# EAGLE board uLements_v2.5 (EAGLE 9.2.1), part 1 of 2
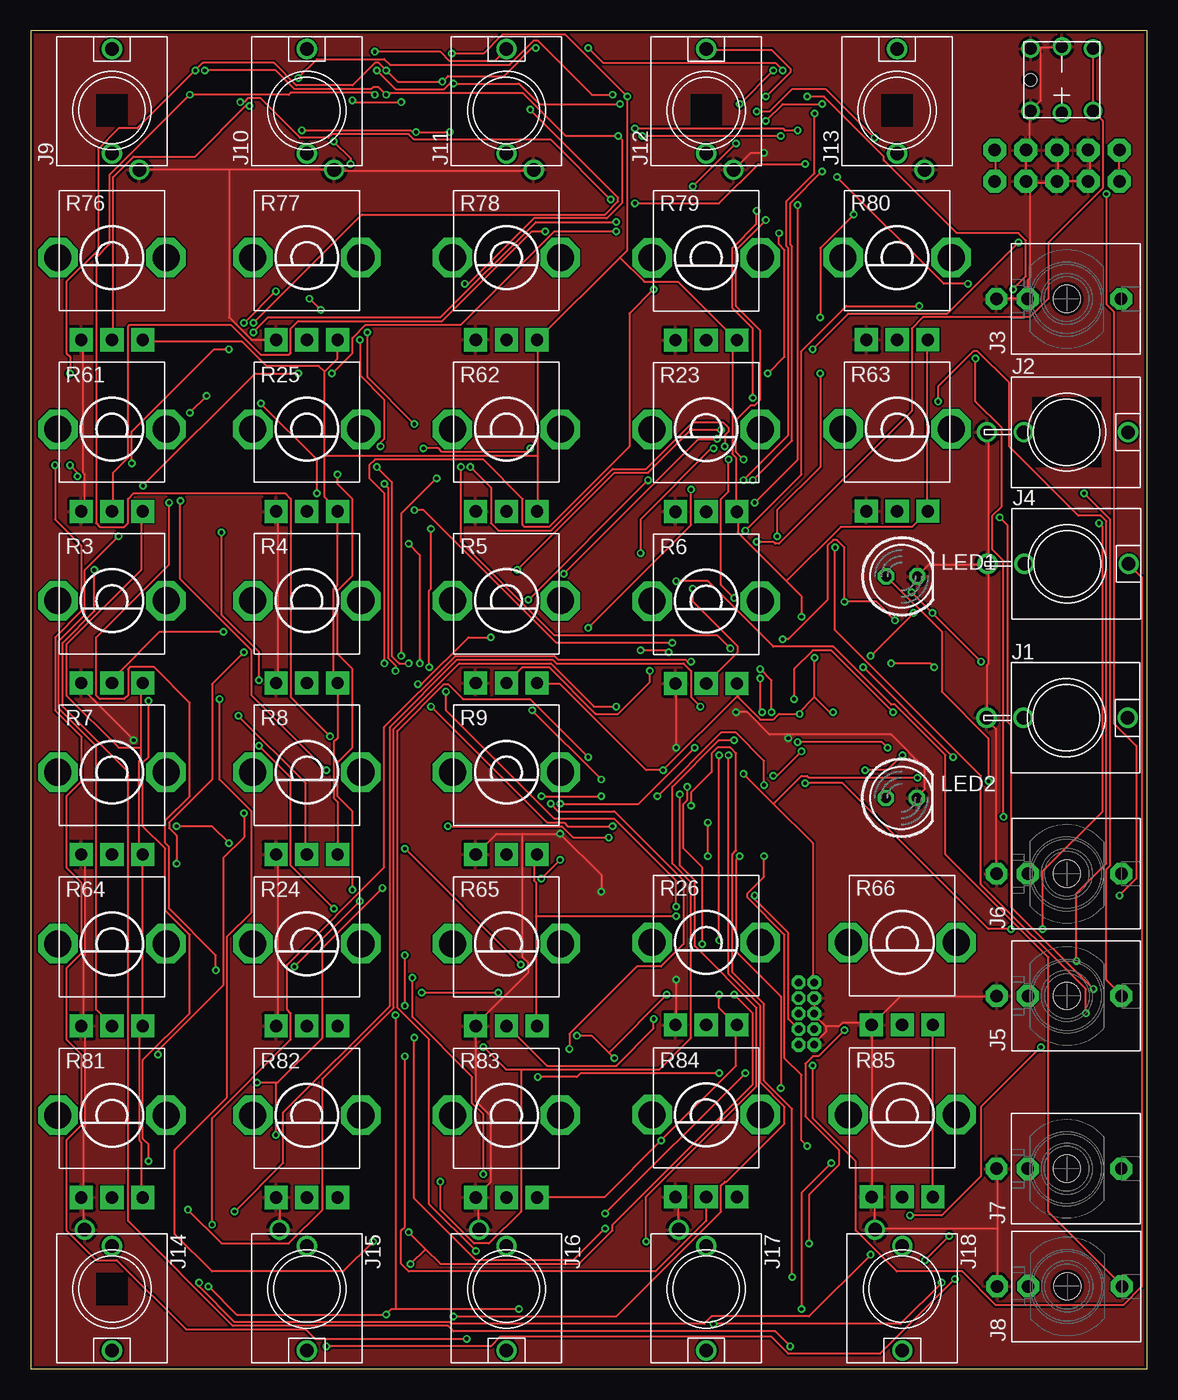
[diagram p5: board, top side]
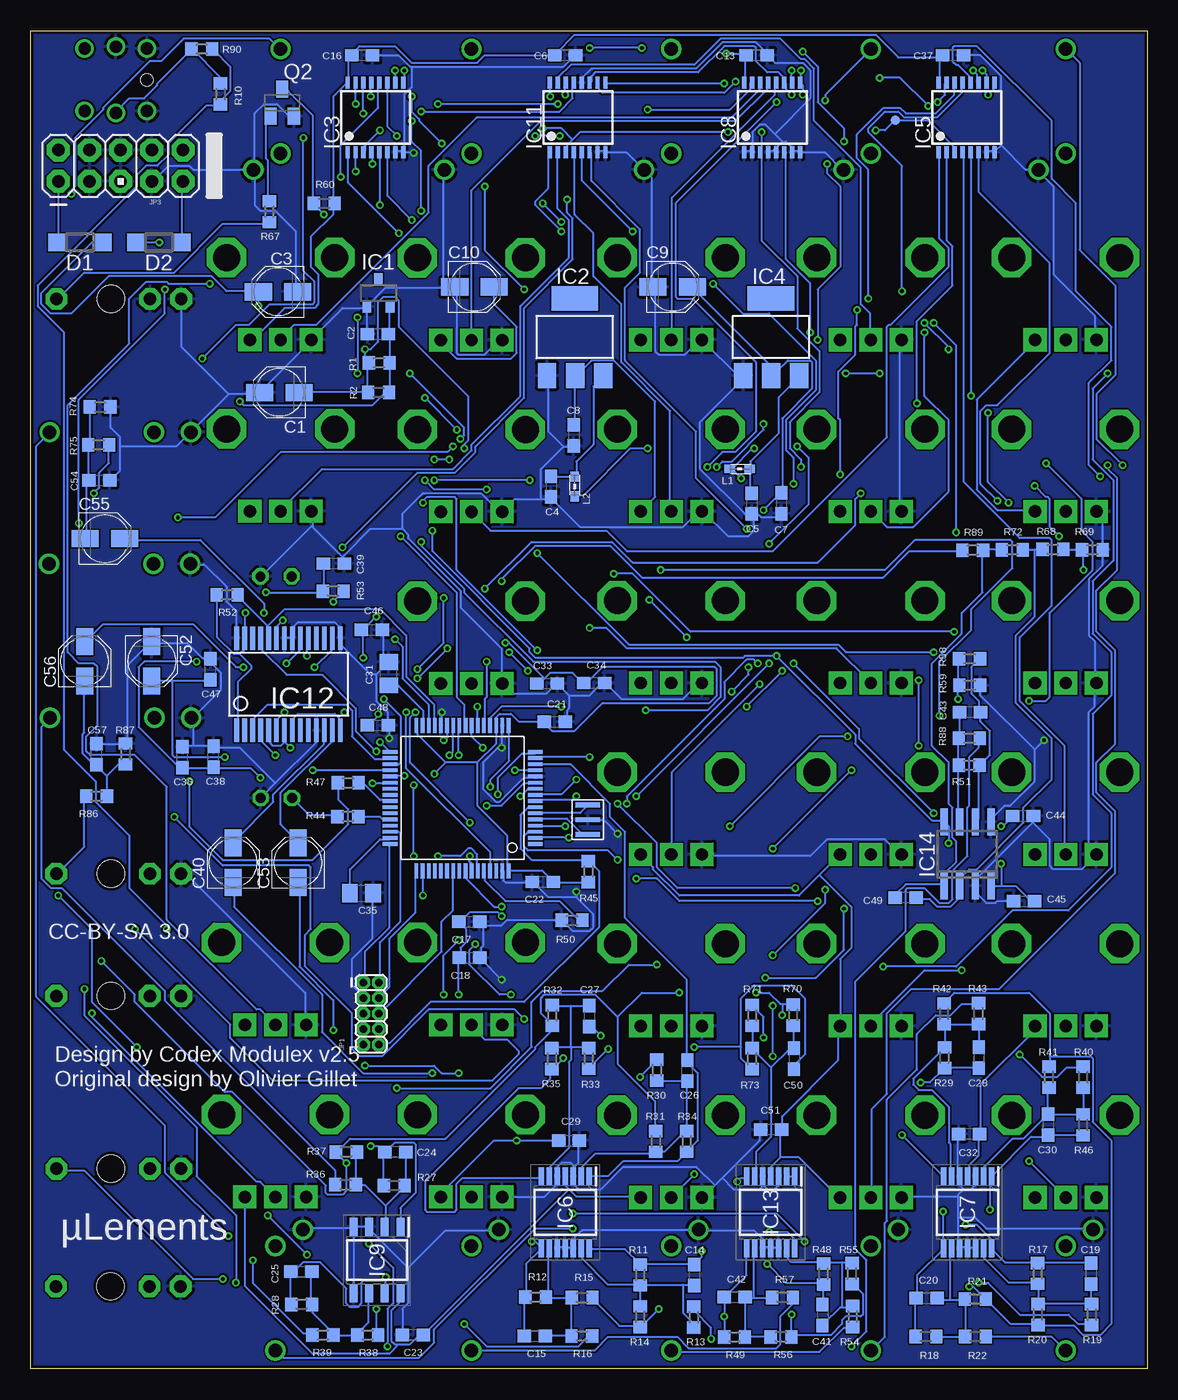
[diagram p6: board, bottom side, seen from below]

Size 90.94 x 109 mm. Coordinates in mm from the lower left corner, seen from the top.
Outline: 0,0 90.94,0 90.94,109 0,109 0,0
Copper layers (1*16): Top 0.035mm / dielectric 1.5mm / Bottom 0.035mm
Design rules "dirt_cheap_dirty_boards.v1.1": minimum track width 6mil, minimum drill 12mil, track to track 6mil, track to pad 6mil, pad to pad 6mil, via to via 6mil, smd to smd 0mil, copper to edge 10mil, drill to drill 10mil, minimum pad ring 10mil, minimum via ring 6mil, stop-mask expansion 2mil, vias tented up to drill 25mil, thermal gap 10mil

## Footprints (pad centres in the part's own frame; a part is rotated, then mirrored left to right if it is on the bottom)
PANASONIC_B = smd 2.2 x 1.4: + 1.6,0; - -1.6,0
C0603 = smd 1.1 x 1: 1 -0.85,0; 2 0.85,0
C0805 = smd 1.3 x 1.5: 1 -0.95,0; 2 0.95,0
SOD123 = smd 1.4 x 1.4: A 1.9,0; C -1.9,0
DBZ_R-PDSO-G3 = smd 0.7 x 1: 1 -0.95,-1.1; 2 0.95,-1.1; 3 0,1.1
SOT223 = smd 1.499 x 2.007: 1 -2.261,-3.15; 2 0.025,-3.15; 3 2.311,-3.15 | smd 3.81 x 2.007: 4 0,3.15
TSSOP16 = smd 0.35 x 1: 1 -1.95,-2.825; 2 -1.3,-2.825; 3 -0.65,-2.825; 4 0,-2.825; 5 0.65,-2.825; 6 1.3,-2.825; 7 1.95,-2.825; 8 2.6,-2.825; 9 2.6,2.825; 10 1.95,2.825; 11 1.3,2.825; 12 0.65,2.825; 13 0,2.825; 14 -0.65,2.825; 15 -1.3,2.825; 16 -1.95,2.825
SOP65P640X120-14N = smd 1.475 x 0.45: 1 -2.938,1.95; 2 -2.938,1.3; 3 -2.938,0.65; 4 -2.938,0; 5 -2.938,-0.65; 6 -2.938,-1.3; 7 -2.938,-1.95; 8 2.938,-1.95; 9 2.938,-1.3; 10 2.938,-0.65; 11 2.938,0; 12 2.938,0.65; 13 2.938,1.3; 14 2.938,1.95
SOIC127P600X175-8N = smd 1.5 x 0.65: 1 -2.7,1.905; 2 -2.7,0.635; 3 -2.7,-0.635; 4 -2.7,-1.905; 5 2.7,-1.905; 6 2.7,-0.635; 7 2.7,0.635; 8 2.7,1.905
TQFP-10X10-64 = smd 1.2 x 0.3: 1 -5.936,3.75; 2 -5.936,3.25; 3 -5.936,2.75; 4 -5.936,2.25; 5 -5.936,1.75; 6 -5.936,1.25; 7 -5.936,0.75; 8 -5.936,0.25; 9 -5.936,-0.25; 10 -5.936,-0.75; 11 -5.936,-1.25; 12 -5.936,-1.75; 13 -5.936,-2.25; 14 -5.936,-2.75; 15 -5.936,-3.25; 16 -5.936,-3.75; 33 5.886,-3.75; 34 5.886,-3.25; 35 5.886,-2.75; 36 5.886,-2.25; 37 5.886,-1.75; 38 5.886,-1.25; 39 5.886,-0.75; 40 5.886,-0.25; 41 5.886,0.25; 42 5.886,0.75; 43 5.886,1.25; 44 5.886,1.75; 45 5.886,2.25; 46 5.886,2.75; 47 5.886,3.25; 48 5.886,3.75 | smd 0.3 x 1.2: 17 -3.75,-5.911; 18 -3.25,-5.911; 19 -2.75,-5.911; 20 -2.25,-5.911; 21 -1.75,-5.911; 22 -1.25,-5.911; 23 -0.75,-5.911; 24 -0.25,-5.911; 25 0.25,-5.911; 26 0.75,-5.911; 27 1.25,-5.911; 28 1.75,-5.911; 29 2.25,-5.911; 30 2.75,-5.911; 31 3.25,-5.911; 32 3.75,-5.911; 49 3.75,5.936; 50 3.25,5.936; 51 2.75,5.936; 52 2.25,5.936; 53 1.75,5.936; 54 1.25,5.936; 55 0.75,5.936; 56 0.25,5.936; 57 -0.25,5.936; 58 -0.75,5.936; 59 -1.25,5.936; 60 -1.75,5.936; 61 -2.25,5.936; 62 -2.75,5.936; 63 -3.25,5.936; 64 -3.75,5.936
SSOP28 = smd 0.381 x 1.905: 1 -4.55,-3.752; 2 -3.9,-3.752; 3 -3.25,-3.752; 4 -2.6,-3.752; 5 -1.95,-3.752; 6 -1.3,-3.752; 7 -0.65,-3.752; 8 0,-3.752; 9 0.65,-3.752; 10 1.3,-3.752; 11 1.95,-3.752; 12 2.6,-3.752; 13 3.25,-3.752; 14 3.9,-3.752; 15 3.9,3.752; 16 3.25,3.752; 17 2.6,3.752; 18 1.95,3.752; 19 1.3,3.752; 20 0.65,3.752; 21 0,3.752; 22 -0.65,3.752; 23 -1.3,3.752; 24 -1.95,3.752; 25 -2.6,3.752; 26 -3.25,3.752; 27 -3.9,3.752; 28 -4.55,3.752
SO08 = smd 0.6 x 2.2: 1 -1.905,-2.6; 2 -0.635,-2.6; 3 0.635,-2.6; 4 1.905,-2.6; 5 1.905,2.6; 6 0.635,2.6; 7 -0.635,2.6; 8 -1.905,2.6
WQP-PJ301M-12_JACK = drill 1.1: P$1 0,5; P$2 0,-3.5; P$3 0,-6.5
WQP_PJ_301M6 = drill 1.016 pad 1.778 octagon: P1 0,-5.715; P2 0,-3.175; P3 0,4.445 | hole 2.2: 0,0
INSTRUO_S_JACK_S2_INV = drill 1.1: GND 2.223,-4.826; NORM 0,-3.5; TIP 0,5
2X5-1.27 = drill 0.61 pad 1.067 octagon: 1 -1.27,3.81; 2 0,3.81; 3 -1.27,2.54; 4 0,2.54; 5 -1.27,1.27; 6 0,1.27; 7 -1.27,0; 8 0,0; 9 -1.27,-1.27; 10 0,-1.27
AVR_ICSP = drill 1.016 pad 1.88 octagon: 1 -1.27,5.08; 2 1.27,5.08; 3 -1.27,2.54; 4 1.27,2.54; 5 -1.27,0; 6 1.27,0; 7 -1.27,-2.54; 8 1.27,-2.54; 9 -1.27,-5.08; 10 1.27,-5.08
0603 = smd 0.85 x 0.7: 1 -0.9,0; 2 0.7,0
LED5MM = drill 0.813 octagon: A -1.27,0; K 1.27,0
INSTRUO_CRYSTAL_SMALLER = smd 0.4 x 2: GND 0,0; X1 -1.2,0; X2 1.2,0
SOT23-BEC = smd 1 x 1.4: B -0.95,-1.1; C 0,1.1; E 0.95,-1.1
R0603 = smd 1 x 1.1: 1 -0.85,0; 2 0.85,0
OG-POTS_ALPS_POT_VERTICAL = drill 1 pad 1.88 square: P$1 -2.5,6.7; P$2 0,6.7; P$3 2.5,6.7 | drill 2.2 pad 3.175 octagon: P$4 -4.4,0; P$5 4.4,0
ALPS_POT_VERTICAL = drill 1 pad 1.88 square: P$1 -2.5,6.7; P$2 0,6.7; P$3 2.5,6.7 | drill 2.2 pad 3.175 octagon: P$4 -4.4,0; P$5 4.4,0
PAD.03X.03 = smd 0.762 x 0.762: P$1 0,0
INSTRUO_PB6149L = drill 1: 1 2.54,-2.54; 2 2.54,2.54; 3 -2.54,-2.54; 4 -2.54,2.54; A 0,-2.7; K 0,2.7 | hole 1: -2.54,0

## Placement (x,y rotation side)
C1  22u  [PANASONIC_B]  70.68,79.53 180 bottom
C2  100n  [C0603]  62.66,84.28 180 bottom
C3  22u  [PANASONIC_B]  70.79,87.73 180 bottom
C4  100n  [C0603]  48.55,71.86 270 bottom
C5  100n  [C0603]  32.2,70.48 270 bottom
C6  100n  [C0603]  47.41,107 0 bottom
C7  100n  [C0603]  29.79,70.5 270 bottom
C8  100n  [C0603]  46.71,76.03 270 bottom
C9  22u  [PANASONIC_B]  38.64,88.13 0 bottom
C10  22u  [PANASONIC_B]  54.79,88.13 0 bottom
C13  100n  [C0603]  31.79,107 0 bottom
C14  3.3n  [C0603]  36.89,7.64 270 bottom
C15  3.3n  [C0603]  49.88,2.68 0 bottom
C16  100n  [C0603]  63.95,107 0 bottom
C17  1u  [C0603]  55.21,36.42 0 bottom
C18  100n  [C0603]  55.19,33.49 0 bottom
C19  3.3n  [C0603]  4.55,7.76 270 bottom
C20  3.3n  [C0603]  17.97,5.76 0 bottom
C21  100n  [C0603]  48.24,52.7 0 bottom
C22  100n  [C0603]  49.23,39.66 180 bottom
C23  100n  [C0603]  59.81,2.76 180 bottom
C24  3.3n  [C0603]  61.24,17.65 180 bottom
C25  3.3n  [C0603]  68.89,7.93 0 bottom
C26  3.3n  [C0603]  37.44,24.3 90 bottom
C27  3.3n  [C0603]  45.44,28.74 270 bottom
C28  3.3n  [C0603]  13.71,25.33 270 bottom
C29  100n  [C0603]  47.09,18.6 0 bottom
C30  3.3n  [C0603]  8.05,19.89 270 bottom
C31  2.2u  [C0805]  61.77,56.63 90 bottom
C32  100n  [C0603]  14.49,19.13 180 bottom
C33  100n  [C0603]  48.88,55.82 0 bottom
C34  100n  [C0603]  45.03,55.86 0 bottom
C35  2.2u  [C0805]  63.99,38.75 0 bottom
C36  1u  [C0603]  78.57,49.82 90 bottom
C37  100n  [C0603]  15.79,107 0 bottom
C38  100n  [C0603]  76.04,49.86 90 bottom
C39  100n  [C0603]  66.24,65.6 0 bottom
C40  10u  [PANASONIC_B]  74.44,41.23 90 bottom
C41  3.3n  [C0603]  26.44,4.37 270 bottom
C42  3.3n  [C0603]  33.59,5.84 0 bottom
C43  18p  [C0603]  14.43,53.49 180 bottom
C44  100n  [C0603]  10.11,45.04 0 bottom
C45  100n  [C0603]  10.02,38.1 0 bottom
C46  100n  [C0603]  63.15,60.2 0 bottom
C47  100n  [C0603]  76.29,56.98 90 bottom
C48  1u  [C0603]  62.66,52.42 0 bottom
C49  18p  [C0603]  19.68,38.37 180 bottom
C50  3.3n  [C0603]  28.77,25.25 270 bottom
C51  100n  [C0603]  30.62,19.48 180 bottom
C52  10u  [PANASONIC_B]  81.09,57.63 270 bottom
C53  10u  [PANASONIC_B]  69.15,41.23 90 bottom
C54  220p  [C0603]  85.34,72.38 0 bottom
C55  10u  [PANASONIC_B]  84.89,67.63 0 bottom
C56  10u  [PANASONIC_B]  86.54,57.63 90 bottom
C57  220p  [C0603]  85.58,50.05 90 bottom
D1  1N5819HW  [SOD123]  86.92,91.75 180 bottom
D2  1N5819HW  [SOD123]  80.49,91.75 180 bottom
IC1  LM4040B10  [DBZ_R-PDSO-G3]  62.61,87.63 0 bottom
IC2  LM1117-3.3  [SOT223]  46.62,84.05 0 bottom
IC3  4051PW  [TSSOP16]  63.18,101.93 0 bottom
IC4  LM1117-3.3  [SOT223]  30.64,84.05 0 bottom
IC5  4051PW  [TSSOP16]  15.02,101.93 0 bottom
IC6  MCP6004-I_ST  [SOP65P640X120-14N]  47.4,12.75 270 bottom
IC7  MCP6004-I_ST  [SOP65P640X120-14N]  14.63,12.75 270 bottom
IC8  4051PW  [TSSOP16]  30.86,101.93 0 bottom
IC9  MCP6002-I_SN  [SOIC127P600X175-8N]  62.73,8.85 270 bottom
IC10  STM32F405RGT6  [TQFP-10X10-64]  55.77,46.5 180 bottom
IC11  4051PW  [TSSOP16]  46.71,101.93 0 bottom
IC12  WM8731  [SSOP28]  69.61,55.76 0 bottom
IC13  MCP6004-I_ST  [SOP65P640X120-14N]  30.66,12.75 270 bottom
IC14  LME49720  [SO08]  14.62,41.93 0 bottom
J1  [WQP-PJ301M-12_JACK]  84.37,53.03 270 top
J2  [WQP-PJ301M-12_JACK]  84.4,76.29 270 top
J3  PJ301_THONKICONN6  [WQP_PJ_301M6]  84.4,87.15 270 top
J4  [WQP-PJ301M-12_JACK]  84.44,65.57 270 top
J5  PJ301_THONKICONN6  [WQP_PJ_301M6]  84.41,30.37 270 top
J6  PJ301_THONKICONN6  [WQP_PJ_301M6]  84.4,40.33 270 top
J7  PJ301_THONKICONN6  [WQP_PJ_301M6]  84.4,16.3 270 top
J8  PJ301_THONKICONN6  [WQP_PJ_301M6]  84.44,6.72 270 top
J9  [INSTRUO_S_JACK_S2_INV]  6.62,102.5 0 top
J10  [INSTRUO_S_JACK_S2_INV]  22.5,102.5 0 top
J11  [INSTRUO_S_JACK_S2_INV]  38.76,102.5 0 top
J12  [INSTRUO_S_JACK_S2_INV]  55.03,102.5 0 top
J13  [INSTRUO_S_JACK_S2_INV]  70.58,102.5 0 top
J14  [INSTRUO_S_JACK_S2_INV]  6.62,6.5 180 top
J15  [INSTRUO_S_JACK_S2_INV]  22.5,6.5 180 top
J16  [INSTRUO_S_JACK_S2_INV]  38.76,6.5 180 top
J17  [INSTRUO_S_JACK_S2_INV]  55.03,6.5 180 top
J18  [INSTRUO_S_JACK_S2_INV]  71,6.5 180 top
JP1  M05X2MINIJTAG  [2X5-1.27]  62.57,27.66 0 bottom
JP3  M05X2PTH  [AVR_ICSP]  83.61,98 90 bottom
L1  [0603]  33.08,73.3 0 bottom
L2  [0603]  46.62,71.98 90 bottom
LED1  SSL-LX5093TC  [LED5MM]  70.96,64.55 0 top
LED2  SSL-LX5093PC  [LED5MM]  70.93,46.51 0 top
Q1  8MHz  [INSTRUO_CRYSTAL_SMALLER]  45.56,44.73 270 bottom
Q2  MMBT3904  [SOT23-BEC]  70.45,103.13 0 bottom
R1  1.0k  [R0603]  62.55,81.94 0 bottom
R2  1.0k  [R0603]  62.6,79.53 0 bottom
R3  10kB  [OG-POTS_ALPS_POT_VERTICAL]  6.62,62.57 180 top
R4  10kB  [OG-POTS_ALPS_POT_VERTICAL]  22.5,62.57 180 top
R5  10kB  [OG-POTS_ALPS_POT_VERTICAL]  38.76,62.57 180 top
R6  10kB  [OG-POTS_ALPS_POT_VERTICAL]  55.03,62.53 180 top
R7  10kB  [OG-POTS_ALPS_POT_VERTICAL]  6.62,48.6 180 top
R8  10kB  [OG-POTS_ALPS_POT_VERTICAL]  22.5,48.6 180 top
R9  10kB  [OG-POTS_ALPS_POT_VERTICAL]  38.76,48.6 180 top
R10  68  [R0603]  75.47,103.84 90 bottom
R11  20k  [R0603]  41.28,7.65 270 bottom
R12  20k  [R0603]  49.81,5.84 0 bottom
R13  100k  [R0603]  36.91,4.21 90 bottom
R14  120k  [R0603]  41.29,4.25 270 bottom
R15  120k  [R0603]  46.02,5.79 0 bottom
R16  100k  [R0603]  46.04,2.68 0 bottom
R17  20k  [R0603]  8.92,7.78 270 bottom
R18  20k  [R0603]  18,2.63 0 bottom
R19  100k  [R0603]  4.51,4.42 270 bottom
R20  120k  [R0603]  8.89,4.42 270 bottom
R21  120k  [R0603]  13.99,5.68 0 bottom
R22  100k  [R0603]  13.97,2.63 0 bottom
R23  10kB  [OG-POTS_ALPS_POT_VERTICAL]  55.03,76.52 180 top
R24  10kB  [OG-POTS_ALPS_POT_VERTICAL]  22.5,34.62 180 top
R25  10kB  [OG-POTS_ALPS_POT_VERTICAL]  22.5,76.54 180 top
R26  10kB  [OG-POTS_ALPS_POT_VERTICAL]  55.03,34.72 180 top
R27  47k  [R0603]  61.33,14.92 180 bottom
R28  20k  [R0603]  68.86,5.25 0 bottom
R29  20k  [R0603]  16.51,25.34 270 bottom
R30  100k  [R0603]  39.92,24.33 270 bottom
R31  200k  [R0603]  40.01,18.52 270 bottom
R32  120k  [R0603]  48.46,28.78 90 bottom
R33  100k  [R0603]  45.48,25.28 90 bottom
R34  33k  [R0603]  37.5,18.52 270 bottom
R35  20k  [R0603]  48.47,25.27 270 bottom
R36  100k  [R0603]  65.29,15 0 bottom
R37  180k  [R0603]  65.23,17.67 0 bottom
R38  120k  [R0603]  63.49,2.76 0 bottom
R39  100k  [R0603]  67.14,2.76 180 bottom
R40  100k  [R0603]  5.21,23.76 270 bottom
R41  120k  [R0603]  7.99,23.76 270 bottom
R42  120k  [R0603]  16.54,28.92 270 bottom
R43  100k  [R0603]  13.73,28.93 270 bottom
R44  2.2k  [R0603]  65.1,44.99 180 bottom
R45  10k  [R0603]  45.5,40.5 270 bottom
R46  20k  [R0603]  5.2,19.87 270 bottom
R47  2.2k  [R0603]  65.08,47.73 180 bottom
R48  20k  [R0603]  26.36,7.73 90 bottom
R49  20k  [R0603]  33.6,2.59 0 bottom
R50  10k  [R0603]  46.83,36.53 0 bottom
R51  47k  [R0603]  14.49,49.18 0 bottom
R52  2.2k  [R0603]  74.93,63.05 180 bottom
R53  2.2k  [R0603]  66.29,63.35 180 bottom
R54  100k  [R0603]  23.98,4.26 270 bottom
R55  120k  [R0603]  24.04,7.76 270 bottom
R56  120k  [R0603]  29.81,2.6 0 bottom
R57  100k  [R0603]  29.69,5.82 0 bottom
R58  6.8k  [R0603]  14.45,57.84 180 bottom
R59  47k  [R0603]  14.45,55.67 180 bottom
R60  10k  [R0603]  67.03,94.92 0 bottom
R61  10kB  [OG-POTS_ALPS_POT_VERTICAL]  6.62,76.54 180 top
R62  10kB  [OG-POTS_ALPS_POT_VERTICAL]  38.76,76.54 180 top
R63  10kB  [OG-POTS_ALPS_POT_VERTICAL]  70.58,76.56 180 top
R64  10kB  [OG-POTS_ALPS_POT_VERTICAL]  6.62,34.62 180 top
R65  10kB  [OG-POTS_ALPS_POT_VERTICAL]  38.76,34.62 180 top
R66  10kB  [OG-POTS_ALPS_POT_VERTICAL]  71,34.72 180 top
R67  100k  [R0603]  71.49,94.26 90 bottom
R68  6.8k  [R0603]  7.67,66.74 0 bottom
R69  47k  [R0603]  4.45,66.72 180 bottom
R70  120k  [R0603]  28.83,28.81 270 bottom
R71  100k  [R0603]  32.16,28.79 270 bottom
R72  47k  [R0603]  10.97,66.72 0 bottom
R73  20k  [R0603]  32.18,25.26 270 bottom
R74  6.8k  [R0603]  85.29,78.34 180 bottom
R75  36k  [R0603]  85.4,75.26 0 bottom
R76  10kB  [ALPS_POT_VERTICAL]  6.62,90.52 180 top
R77  10kB  [ALPS_POT_VERTICAL]  22.5,90.52 180 top
R78  10kB  [ALPS_POT_VERTICAL]  38.76,90.52 180 top
R79  10kB  [ALPS_POT_VERTICAL]  55.03,90.5 180 top
R80  10kB  [ALPS_POT_VERTICAL]  70.58,90.52 180 top
R81  10kB  [ALPS_POT_VERTICAL]  6.62,20.65 180 top
R82  10kB  [ALPS_POT_VERTICAL]  22.5,20.65 180 top
R83  10kB  [ALPS_POT_VERTICAL]  38.76,20.65 180 top
R84  10kB  [ALPS_POT_VERTICAL]  55.03,20.7 180 top
R85  10kB  [ALPS_POT_VERTICAL]  71,20.7 180 top
R86  36k  [R0603]  85.57,46.64 180 bottom
R87  6.8k  [R0603]  83.2,50.09 270 bottom
R88  1.0k  [R0603]  14.48,51.36 180 bottom
R89  1.0k  [R0603]  14.2,66.69 0 bottom
R90  68  [R0603]  77,107.5 180 bottom
TP1  ADC_TEST  [PAD.03X.03]  20.5,101.7 90 bottom
U$1  INSTRUO_PB6149_FIXED  [INSTRUO_PB6149L]  84,105 0 top

## Tracks (layer width: path | path; a pad name or v marks a point on that pad's centre or on a via)
+3V3  (via drill 0.3)
  Top 0.152: v71.78,63.25 v73.46,61.57 v77.42,57.61 | v58.06,48.46 60.5,46.02 | 60.5,46.02 63.7,42.82 63.7,31.55 JP1.1 | v31.24,69.95 32,69.95 42.82,59.13 v52.27,59.13 | v72.24,48.16 63.4,48.16 63.25,48.31 62.79,48.31 60.5,46.02
  Bottom 0.152: C39.1 67.06,65.53 67.06,63.4 R53.2 67.21,63.25 v71.78,63.25 | 73.91,58.22 74.37,58.22 75.74,59.59 75.74,62.94 R52.2 | 73.91,58.22 73.61,58.52 73.61,59.44 IC12.27 73.46,59.59 v73.46,61.57 | 73.91,58.22 73,57.3 73,57 74.07,55.93 74.07,52.12 IC12.1 | v77.42,57.61 81.69,57.61 82.14,57.15 82.14,52.27 78.94,49.07 78.64,49.07 C36.1 78.49,48.92 76.05,48.92 C38.1 75.89,48.92 73,48.92 v72.24,48.16 | 30.18,81.23 30.48,80.92 IC4.2 30.18,81.23 | 30.18,81.23 29.26,82.14 27.43,82.14 27.28,81.99 27.28,79.86 29.72,77.42 29.72,71.48 C7.1 29.87,71.32 v31.24,69.95 | 30.18,81.23 37.03,88.09 C9.+ | IC10.48 61.72,42.67 61.72,35.97 63.7,33.98 63.7,31.55 JP1.1 | R45.2 45.57,39.62 48.31,39.62 C22.1 48.46,39.78 49.23,40.54 51.97,40.54 IC10.64 52.12,40.69 52.12,43.43 54.56,45.87 54.56,49.38 | 49.07,56.24 48.62,56.69 46.79,56.69 46.02,55.93 C34.1 45.87,55.93 45.57,55.93 44.35,57.15 35.2,57.15 35.05,57 35.05,54.86 35.66,54.25 44.35,54.25 46.63,51.97 48.46,51.97 49.07,52.58 C21.1 49.23,52.73 51.21,52.73 51.82,53.34 52.73,53.34 53.03,53.03 53.03,52.43 IC10.19 53.03,52.27 53.03,50.9 54.56,49.38 | 49.07,56.24 49.38,55.93 49.68,55.93 C33.1 | 57.15,49.38 59.44,51.66 59.44,52.27 IC10.32 | 54.56,49.38 57.15,49.38 | 57.15,49.38 v58.06,48.46 | v52.27,59.13 51.97,59.13 49.07,56.24
+3V3_A  (via drill 0.3)
  Top 0.152: 62.48,53.34 60.96,53.34 60.5,52.88 59.44,52.88 57.61,54.71 57.61,54.86 | 57.61,54.86 57.61,55.78 R6.P$1 | 63.86,54.71 v63.86,57.91 | 62.48,53.34 63.86,54.71 | 62.48,53.34 v62.64,53.34 | 57.61,54.86 v51.51,48.77 50.14,48.77 43.13,55.78 41.3,55.78 R5.P$1 | v65.38,53.49 65.08,53.49 63.86,54.71 | 48.01,90.53 41.3,83.82 R78.P$1 41.3,83.67 41.3,74.37 | 48.01,90.53 48.62,91.14 v48.62,103.63 43.59,108.66 38.41,108.66 36.88,107.14 v34.29,107.14 | 41.3,74.37 41.3,69.95 R62.P$1 | 48.01,90.53 49.99,88.54 52.73,88.54 57.45,83.82 R79.P$1 57.45,83.67 57.15,83.36 57.15,74.52 57.45,74.22 57.45,69.95 R23.P$1 57.61,69.8 57.61,68.12 61.57,64.16 | v62.79,61.27 62.79,62.94 61.57,64.16 | R80.P$1 73,83.82 73,69.95 R63.P$1 73,69.8 71.78,68.58 65.99,68.58 61.57,64.16 | R85.P$1 73.46,14.02 73.46,27.89 R66.P$1 | v56.08,30.48 56.08,29.41 57.45,28.04 R26.P$1 57.45,27.89 57.45,24.69 v51.36,18.59 46.79,14.02 41.3,14.02 R83.P$1 | R81.P$1 8.99,14.02 8.99,18.44 8.84,18.59 8.84,27.74 8.99,27.89 R64.P$1 9.14,28.04 9.14,41.76 R7.P$1 8.99,41.91 8.84,42.06 8.84,49.53 8.99,49.68 8.99,50.6 | 8.99,50.6 8.99,55.78 R3.P$1 | 41.15,36.88 41.15,39.62 41,39.78 41,41.6 41.15,41.76 R9.P$1 | 41.15,36.88 41.15,28.04 R65.P$1 | R8.P$1 24.99,46.18 24.69,46.48 24.69,51.05 24.99,51.36 24.99,55.78 R4.P$1 24.99,55.93 24.69,56.24 24.69,63.55 24.99,63.86 24.99,69.8 R25.P$1 24.99,69.95 23.93,71.02 23.93,74.37 | 23.93,81.23 24.99,82.3 24.99,83.67 R77.P$1 | 23.93,74.37 23.93,81.23 | 23.93,81.23 23.47,81.69 19.2,81.69 17.22,83.67 9.14,83.67 R76.P$1 | 8.99,50.6 7.16,50.6 2.9,54.86 2.9,58.98 8.99,65.08 8.99,69.8 R61.P$1
  Top 0.152: 41.15,36.88 v52.58,36.88 | 23.93,74.37 41.3,74.37
  Bottom 0.152: 65.84,53.03 65.84,52.12 IC12.14 | 65.84,53.03 66.14,53.34 69.19,53.34 69.49,53.03 69.49,52.12 IC12.8 | v62.64,53.34 62.64,53.19 63.4,52.43 C48.1 | v63.86,57.91 63.86,60.05 C46.1 63.86,60.2 v62.79,61.27 | v51.51,48.77 49.84,48.77 IC10.13 | v65.38,53.49 65.84,53.03 | C10.+ 53.19,88.09 53.19,86.72 51.36,84.89 51.36,82.75 51.82,82.3 56.24,82.3 57.61,83.67 R79.P$1 | C8.1 46.63,76.96 46.63,80.77 IC2.2 46.48,80.92 45.26,82.14 43.43,82.14 40.08,78.79 40.08,71.02 41.15,69.95 R62.P$1 | IC8.16 32.77,104.85 32.77,106.98 C13.1 32.77,107.14 v34.29,107.14 | v48.62,103.63 48.62,104.7 IC11.16 | 16.92,106.83 16.92,104.85 IC5.16 | 16.92,106.83 16.76,106.98 C37.1 16.92,106.83 | 16.92,106.83 20.27,106.83 22.1,108.66 46.63,108.66 48.16,107.14 C6.1 48.31,106.98 53.95,106.98 54.56,106.38 59.89,106.38 61.27,107.75 64.16,107.75 64.77,107.14 C16.1 64.92,106.98 65.08,106.83 65.08,104.85 IC3.16 65.23,104.7 66.29,103.63 66.29,94.94 R60.2 66.29,94.79 66.29,94.03 68.12,92.2 68.12,89.76 67.51,89.15 67.51,86.72 67.82,86.41 70.26,86.41 72.69,83.97 73,83.97 R80.P$1 | C29.1 48.01,18.59 v51.36,18.59 53.19,18.59 57.45,14.33 57.45,14.02 R84.P$1 | v56.08,30.48 56.08,33.38 C18.1 55.93,33.53 55.93,34.29 55.47,34.75 55.47,35.81 55.93,36.27 C17.1 55.93,36.42 55.17,37.19 52.88,37.19 v52.58,36.88 | 60.96,1.98 61.27,1.98 61.57,2.29 61.57,4.72 60.96,5.33 60.96,6.1 IC9.8 | 60.96,1.98 60.05,1.98 59.28,2.74 58.98,2.74 C23.1 58.83,2.9 47.09,14.63 | 47.09,14.63 46.48,14.02 41.3,14.02 R83.P$1 | 47.09,14.63 47.4,14.94 47.4,15.54 IC6.4 | 60.96,1.98 61.72,1.22 67.97,1.22 73.46,6.71 73.46,13.87 R85.P$1
  Bottom 0.152: IC7.4 14.48,15.7 14.48,16.61 13.72,17.37 13.72,19.05 C32.1 13.56,19.2 13.56,23.16 9.14,27.58 9.14,27.89 R64.P$1 | 29.87,17.22 29.87,19.36 C51.1 29.72,19.51 29.72,20.57 25.15,25.15 25.15,27.89 R24.P$1 24.99,28.04 24.99,33.38 24.08,34.29 24.08,37.64 26.67,40.23 | 29.87,17.22 30.63,16.46 30.63,15.7 IC13.4 | 29.87,17.22 28.35,17.22 25.15,14.02 R82.P$1 | R61.P$1 9.14,69.95 12.19,69.95 13.87,71.63 13.87,78.94 9.14,83.67 R76.P$1 | 26.67,40.23 25.15,41.76 R8.P$1 | 26.67,40.23 28.35,38.56 38.1,38.56 40.23,40.69 40.23,40.84 41.15,41.76 R9.P$1
ADC_ADDR_0  (via drill 0.3)
  Top 0.152: v14.17,105.77 19.96,105.77 21.49,104.24 27.74,104.24 27.89,104.39 28.35,104.39 28.8,103.94 | v49.84,100.43 v61.11,100.43 | 28.8,103.94 40.08,103.94 43.59,100.43 v47.85,100.43 48.16,100.13 48.16,94.94 46.94,93.73 41,93.73 35.66,88.39 v35.36,88.39 | 28.8,103.94 v28.96,103.78 | v47.4,44.2 43.74,44.2 43.43,44.5 42.06,44.5 v32.61,53.95 | v29.72,56.84 29.72,57.3 29.11,57.91 29.11,71.78 v28.8,72.08
  Bottom 0.152: v14.17,105.77 13.87,105.46 13.87,104.85 IC5.11 | v28.96,103.78 29.41,104.24 29.41,104.7 IC8.11 29.57,104.85 29.57,105.16 30.02,105.61 30.94,105.61 31.85,106.53 31.85,107.59 32,107.75 34.44,107.75 36.58,105.61 44.96,105.61 45.26,105.31 45.26,104.85 IC11.11 | v61.11,100.43 61.87,101.19 61.87,104.7 IC3.11 | v47.85,100.43 v49.84,100.43 | v47.4,44.2 49.68,44.2 IC10.4 | v29.72,56.84 v32.61,53.95 | v28.8,72.08 28.8,74.22 29.41,74.83 29.41,77.27 26.98,79.7 26.98,82.14 30.79,85.95 32.92,85.95 v35.36,88.39
ADC_ADDR_1  (via drill 0.3)
  Top 0.152: v61.27,105.77 60.66,106.38 46.63,106.38 v45.41,107.59 | v41.15,107.59 40.84,107.59 38.56,105.31 33.98,105.31 v33.53,104.85 29.87,104.85 v28.96,105.77 28.35,106.38 28.04,106.38 26.21,104.55 21.64,104.55 19.81,106.38 14.02,106.38 v13.41,105.77 8.69,101.04 7.16,101.04 5.49,99.36 5.49,91.14 2.9,88.54 2.9,82.75 3.2,82.45 v3.2,81.08 | v41.6,39.93 v43.13,41.45 | v21.49,32.77 v26.82,38.1
  Bottom 0.152: v13.41,105.77 13.11,105.46 13.11,104.85 IC5.10 | v28.96,105.77 28.96,104.85 IC8.10 | v33.53,104.85 34.44,103.94 44.35,103.94 44.65,104.24 44.65,104.7 IC11.10 | v61.27,105.77 61.27,104.85 IC3.10 | v41.15,107.59 v45.41,107.59 | v43.13,41.45 43.89,42.22 50.44,42.22 50.75,42.52 50.75,43.43 50.44,43.74 49.84,43.74 IC10.3 | v41.6,39.93 39.93,39.93 38.1,38.1 v26.82,38.1 | v21.49,32.77 15.54,32.77 10.97,37.34 6.4,37.34 2.9,40.84 2.9,45.26 4.42,46.79 4.42,53.34 2.9,54.86 2.9,58.37 4.42,59.89 4.42,64.16 2.74,65.84 2.74,72.39 4.42,74.07 4.42,79.86 v3.2,81.08
ADC_ADDR_2  (via drill 0.3)
  Top 0.152: v28.04,103.78 27.89,103.94 21.18,103.94 21.03,103.78 v12.95,103.78 6.4,97.23 6.4,91.59 5.33,90.53 5.33,68.89 5.64,68.58 7.62,68.58 7.92,68.89 7.92,70.87 8.38,71.32 20.73,71.32 21.18,70.87 21.18,54.71 v24.38,51.51 | v28.19,105.77 29.72,104.24 33.68,104.24 34.14,104.7 v34.44,104.7 39.78,104.7 41.45,103.02 v48.01,103.02 | v57.76,103.02 v60.5,105.77 | v47.09,43.28 44.2,43.28 43.28,44.2 v33.98,44.2
  Bottom 0.152: v12.95,103.78 12.5,104.24 12.5,104.7 IC5.9 | v28.04,103.78 28.04,104.55 28.19,104.7 IC8.9 28.19,104.85 v28.19,105.77 | v34.44,104.7 44.04,104.7 IC11.9 | v60.5,105.77 60.5,104.85 IC3.9 | v48.01,103.02 v57.76,103.02 | v47.09,43.28 49.68,43.28 IC10.2 | v33.98,44.2 26.67,51.51 v24.38,51.51
ADC_BANK_0  (via drill 0.3)
  Top 0.152: v32.61,68.43 32.61,63.55 32.46,63.4 v32.46,57.15 | v33.83,55.17 33.83,53.65 42.67,44.81 47.55,44.81 52.58,39.78 v52.58,37.64
  Bottom 0.152: v32.61,68.43 36.73,72.54 36.73,76.35 42.52,82.14 42.52,88.09 41.3,89.31 41.3,92.81 45.26,96.77 45.26,99.06 IC11.6 | v32.46,57.15 32.46,56.54 v33.83,55.17 | v52.58,37.64 53.19,37.64 55.47,39.93 55.47,40.54 IC10.57
ADC_BANK_1  (via drill 0.3)
  Top 0.152: v27.43,84.43 27.43,80.77 v31.24,76.96 | v35.05,73.46 35.05,67.36 42.67,59.74 55.93,59.74 v57,58.67 | v59.44,56.24 59.44,53.65 v59.59,53.49 | v55.17,41.76 v55.17,44.5
  Bottom 0.152: v27.43,84.43 27.43,88.39 29.41,90.37 29.41,99.06 IC8.6 | v31.24,76.96 31.24,76.5 33.83,73.91 34.59,73.91 v35.05,73.46 | v59.44,56.24 v57,58.67 | v59.59,53.49 60.05,53.03 60.05,49.38 v55.17,44.5 | v55.17,41.76 55.17,41.3 55.02,41.15 55.02,40.69 IC10.58
ADC_BANK_2  (via drill 0.3)
  Top 0.152: v12.19,70.71 12.19,64.31 17.98,58.52 17.98,54.86 v24.08,48.77 | v39.93,32.92 v30.48,42.37 | v61.11,22.86 61.11,30.33 57.45,33.98 57.45,41.45 v57.76,41.76
  Bottom 0.152: v12.19,70.71 13.56,72.08 13.56,78.03 13.11,78.49 12.19,78.49 7.92,82.75 7.92,90.07 13.72,95.86 13.72,99.06 IC5.6 | v30.48,42.37 v24.08,48.77 | v39.93,32.92 42.22,32.92 44.35,30.79 49.23,30.79 50.14,29.87 50.14,26.21 53.49,22.86 v61.11,22.86 | v57.76,41.76 55.93,41.76 55.32,42.37 55.02,42.37 54.56,41.91 54.56,40.69 IC10.59
ADC_BANK_3  (via drill 0.3)
  Top 0.152: v59.89,93.57 57.45,91.14 57.45,86.56 59.44,84.58 59.44,78.94 58.98,78.49 58.67,78.49 57.45,77.27 57.45,74.68 v58.06,74.07 | v56.84,74.07 56.84,71.48 56.24,70.87 56.24,63.86 v57.3,62.79 | v59.44,57 60.35,56.08 v60.35,53.49
  Bottom 0.152: v59.89,93.57 61.87,95.56 61.87,99.06 IC3.6 | v56.84,74.07 v58.06,74.07 | v57.3,62.79 57.3,59.13 v59.44,57 | v60.35,53.49 60.35,48.92 53.49,42.06 53.49,40.69 IC10.61
ADC_BLOW_SHAPE  (via drill 0.3)
  Top 0.152: v52.88,46.79 52.88,41 54.1,39.78 54.1,34.44 59.13,29.41 59.13,23.01 50.14,14.02 v50.14,10.36
  Bottom 0.152: C15.1 50.75,2.74 50.75,5.79 R12.1 50.6,5.94 50.6,8.53 49.38,9.75 IC6.8 49.38,9.91 49.84,10.36 v50.14,10.36 | v52.88,46.79 52.88,48.16 50.9,50.14 49.84,50.14 IC10.16
ADC_BLOW_TIMBRE  (via drill 0.3)
  Top 0.152: v44.5,27.13 45.72,27.13 47.09,25.76 | v47.55,25.3 47.09,25.76 | v53.49,47.4 53.49,46.33 53.19,46.02 53.19,42.37 54.71,40.84 v54.71,34.59 | 47.09,25.76 v51.82,30.48
  Bottom 0.152: v44.5,27.13 45.11,27.74 45.41,27.74 C27.2 | v47.55,25.3 48.46,24.38 R35.2 48.62,24.38 48.62,23.62 49.38,22.86 51.21,22.86 58.83,15.24 58.83,12.95 58.67,12.8 56.39,12.8 56.24,12.95 56.24,15.09 55.78,15.54 49.38,15.54 IC6.7 | v53.49,47.4 53.49,48.01 51.97,49.53 51.97,52.27 IC10.17 | v54.71,34.59 55.17,34.14 55.17,32.92 52.73,30.48 v51.82,30.48
ADC_BOW_TIMBRE  (via drill 0.3)
  Top 0.152: v45.41,49.84 40.69,54.56 35.2,54.56 33.98,55.78 33.68,55.78 29.87,51.97 29.87,29.41 32.46,26.82 32.46,13.41 v36.27,9.6
  Bottom 0.152: v45.41,49.84 49.68,49.84 IC10.15 | v36.27,9.6 36.27,9.14 36.88,8.53 C14.1 37.03,8.53 41.15,8.53 R11.1 41.3,8.53 42.52,9.75 45.41,9.75 IC6.14
ADC_BRIGHTNESS  (via drill 0.3)
  Top 0.152: v56.84,49.99 56.84,32.16 59.44,29.57 59.44,23.32 61.42,21.34 61.42,19.96 56.69,15.24 56.54,15.24 56.24,14.94 56.24,12.8 47.7,4.27 v34.44,4.27
  Bottom 0.152: R49.1 34.44,2.74 v34.44,4.27 34.44,5.79 C42.1 34.29,5.94 32.61,7.62 32.61,9.75 IC13.8 | v56.84,49.99 56.54,50.29 56.54,52.27 IC10.26
ADC_DAMPING  (via drill 0.3)
  Top 0.152: v54.56,53.95 53.8,54.71 53.8,56.84 53.19,57.45 42.82,57.45 42.52,57.76 34.75,57.76 29.26,52.27 29.26,29.57 20.57,20.88 20.57,16.76 v16.61,12.8
  Bottom 0.152: R18.1 18.9,2.74 18.9,5.64 C20.1 18.75,5.79 18.75,7.62 16.61,9.75 IC7.8 16.61,9.91 v16.61,12.8 | v54.56,53.95 54.56,52.43 IC10.22
ADC_FM  (via drill 0.3)
  Top 0.152: v53.8,45.87 53.8,46.94 55.47,48.62 55.47,50.14 55.93,50.6 57,50.6 57.45,50.14 57.45,42.22 57.15,41.91 57.15,32.31 59.74,29.72 59.74,23.47 62.03,21.18 v62.03,7.47
  Bottom 0.152: R28.1 69.8,5.33 69.8,7.92 C25.1 69.65,8.08 69.34,8.08 68.73,8.69 67.36,8.69 65.23,6.55 65.23,5.33 64.92,5.03 64.31,5.03 64.01,5.33 64.01,7.01 63.86,7.16 62.03,7.16 | v53.8,45.87 52.58,45.87 50.75,47.7 49.84,47.7 IC10.11 | 62.03,7.16 62.03,6.25 IC9.7 | 62.03,7.16 v62.03,7.47
ADC_GEOMETRY  (via drill 0.3)
  Top 0.152: v54.1,50.6 49.53,46.02 v43.13,46.02 | v28.65,39.17 23.77,34.29 23.77,26.98 20.12,23.32 19.96,23.32 | v18.44,23.32 19.96,23.32 | 19.96,23.32 v19.96,19.05
  Bottom 0.152: C28.2 13.72,24.54 16.46,24.54 R29.2 16.61,24.38 17.68,23.32 v18.44,23.32 | v54.1,50.6 55.02,51.51 55.02,52.27 IC10.23 | v43.13,46.02 39.93,42.82 39.93,40.84 38.25,39.17 v28.65,39.17 | v19.96,19.05 16.61,15.7 IC7.7
ADC_POSITION  (via drill 0.3)
  Top 0.152: v56.08,34.9 v56.08,49.99 | v57.3,30.48 58.83,28.96 58.83,23.16 47.4,11.73 47.4,11.28 44.65,8.53 33.38,8.53 32.16,9.75 | v30.79,11.12 32.16,9.75 | 32.16,9.75 v30.94,8.53
  Bottom 0.152: C41.1 26.36,5.33 26.36,6.86 R48.1 26.36,7.01 29.41,7.01 v30.94,8.53 | v56.08,49.99 56.08,52.27 IC10.25 | v56.08,34.9 57.3,33.68 v57.3,30.48 | v30.79,11.12 29.26,11.12 28.8,10.67 28.8,9.91 IC13.14
ADC_POTS  (via drill 0.3)
  Top 0.152: v22.1,100.89 30.94,100.89 31.09,100.74 v31.39,100.74 v34.14,100.74 | v62.48,100.89 61.42,100.89 61.27,101.04 v49.23,101.04 | v41.6,46.63 v46.48,46.63 | v30.79,57.45 30.02,57.45 29.41,58.06 29.41,72.24 v28.19,73.46
  Bottom 0.152: IC5.3 15.7,99.21 15.7,99.52 17.83,101.65 20.42,101.65 TP1.P$1 20.57,101.65 21.34,100.89 v22.1,100.89 | v31.39,100.74 31.39,99.21 IC8.3 31.39,99.06 31.39,91.9 28.5,89 28.5,84.73 26.67,82.91 26.67,79.55 29.11,77.11 29.11,74.98 28.19,74.07 v28.19,73.46 | 46.79,100.13 46.18,100.74 v34.14,100.74 | 46.79,100.13 47.24,99.67 47.24,99.21 IC11.3 | v62.48,100.89 63.7,99.67 63.7,99.21 IC3.3 | v49.23,101.04 47.7,101.04 46.79,100.13 | v46.48,46.63 46.79,46.33 49.68,46.33 IC10.8 | v30.79,57.45 v41.6,46.63
ADC_PRESSURE
  Bottom 0.152: IC10.14 49.68,49.23 46.94,49.23 43.74,46.02 43.74,44.96 42.52,43.74 42.52,36.73 37.49,31.7 37.49,25.3 C26.2 37.34,25.15 37.34,24.84 36.58,24.08 36.58,18.59 R34.2 37.64,17.53 38.25,16.92 42.67,16.92 43.89,15.7 45.41,15.7 IC6.1
ADC_SPACE  (via drill 0.3)
  Top 0.152: v57.3,51.21 56.08,51.21 52.27,47.4 52.27,41.15 53.8,39.62 53.8,26.98 51.21,24.38 39.93,24.38 | 39.93,24.38 38.71,24.38 v36.88,26.21 | v33.38,15.24 33.38,12.95 36.12,10.21 37.34,10.21 39.93,12.8 39.93,24.38
  Bottom 0.152: 33.07,26.21 33.07,25.3 32.31,24.54 R73.2 | 33.07,26.21 33.07,30.18 32,31.24 28.96,31.24 27.89,30.18 27.89,25.6 28.65,24.84 28.65,24.54 C50.2 | v57.3,51.21 57,51.51 57,52.27 IC10.27 | 33.07,26.21 v36.88,26.21 | v33.38,15.24 33.07,15.54 32.61,15.54 IC13.7
ADC_STRIKE_SHAPE  (via drill 0.3)
  Top 0.152: v47.7,53.95 45.87,53.95 42.37,57.45 34.9,57.45 29.57,52.12 29.57,29.41 23.77,23.62 23.77,12.95 21.03,10.21 15.54,10.21 v12.8,12.95
  Bottom 0.152: R46.2 5.33,19.05 7.92,19.05 C30.2 8.08,18.9 9.45,18.9 12.65,15.7 IC7.1 12.8,15.54 v12.8,12.95 | v47.7,53.95 52.58,53.95 53.49,53.03 53.49,52.43 IC10.20
ADC_STRIKE_TIMBRE  (via drill 0.3)
  Top 0.152: v53.8,57.61 53.49,57.61 53.34,57.76 42.98,57.76 42.67,58.06 34.59,58.06 28.8,52.27 28.8,40.84 20.88,32.92 20.88,29.26 21.18,28.96 21.18,26.82 14.78,20.42 v14.78,11.73
  Bottom 0.152: C19.1 4.57,8.69 8.84,8.69 R17.1 8.99,8.69 11.58,8.69 12.65,9.75 IC7.14 12.8,9.91 12.8,10.67 13.87,11.73 v14.78,11.73 | v53.8,57.61 53.8,54.71 53.95,54.56 53.95,52.43 IC10.21
ADC_V_OCT  (via drill 0.3)
  Top 0.152: v51.05,46.63 56.24,51.82 57.45,51.82 59.74,49.53 v59.74,47.55 | v59.74,41.76 59.74,40.08 58.37,38.71 58.37,38.41 61.42,35.36 61.42,25.3 62.79,23.93 62.79,18.59 v63.25,18.14
  Bottom 0.152: C24.2 62.18,17.53 62.18,14.94 R27.2 | v51.05,46.63 50.44,47.24 IC10.10 | v59.74,41.76 v59.74,47.55 | v63.25,18.14 62.64,18.14 62.18,17.68 C24.2 | IC9.1 60.81,11.58 60.81,13.11 59.59,14.33 59.59,18.29 59.74,18.44 61.27,18.44 62.03,17.68 C24.2
AREF_-10  (via drill 0.3)
  Top 0.152: 29.72,4.88 29.41,4.88 v28.96,4.42 16.76,4.42 v14.48,6.71 | 29.72,4.88 v39.78,4.88 | v38.1,30.63 v31.85,30.63 | v62.79,4.88 62.79,14.33 v65.23,16.76 | v73.91,78.79 73.91,80.01 76.81,82.91 77.11,82.91 79.7,80.31 79.7,75.13 85.34,69.49 87.17,69.49 87.63,69.04 87.63,41.15 85.19,38.71 v85.19,33.22 | v29.72,28.8 29.72,4.88
  Bottom 0.152: R15.2 45.11,5.64 42.98,3.5 41.3,3.5 R14.2 41.15,3.5 v39.78,4.88 | 28.96,2.74 25.76,2.74 24.84,3.66 24.84,3.96 24.54,4.27 23.32,4.27 23.16,4.42 23.16,6.1 23.93,6.86 R55.2 | 28.96,2.74 v28.96,4.42 | 28.96,2.74 R56.2 | 7.92,25.45 7.92,28.96 9.6,30.63 15.7,30.63 16.46,29.87 R42.1 | 7.92,25.45 7.92,24.69 R41.1 | 7.92,25.45 4.57,25.45 4.42,25.3 4.42,20.12 2.9,18.59 2.9,3.66 3.81,2.74 5.18,2.74 5.94,3.5 8.84,3.5 R20.2 8.99,3.66 11.12,3.66 13.11,5.64 R21.2 13.26,5.79 14.17,6.71 v14.48,6.71 | 43.13,28.65 43.13,24.84 40.08,21.79 40.08,19.51 R31.1 | 43.13,28.65 44.96,30.48 49.07,30.48 49.38,30.18 49.38,28.96 48.46,28.04 R32.1 48.46,27.89 48.46,27.58 49.84,26.21 49.84,26.06 57.15,18.75 64.92,18.75 65.99,17.68 R37.1 65.99,17.53 v65.23,16.76 65.23,14.48 65.53,14.17 66.75,14.17 66.9,14.33 66.9,14.94 74.52,22.55 75.13,22.55 82.45,29.87 82.45,30.48 v85.19,33.22 | 29.72,29.72 29.87,29.72 30.79,30.63 v31.85,30.63 | 29.72,29.72 28.96,29.72 R70.1 | v38.1,30.63 41.15,30.63 43.13,28.65 | IC1.2 61.72,86.41 61.72,84.43 C2.1 61.72,84.28 61.72,81.99 R1.2 61.72,81.84 61.72,79.55 R2.2 61.87,79.4 62.18,79.4 63.09,78.49 73.61,78.49 v73.91,78.79 | v62.79,4.88 62.79,2.9 R38.2 | 29.72,29.72 v29.72,28.8
BOOT_FLASH
  Bottom 0.152: R50.2 46.02,36.58 46.33,36.58 47.85,38.1 52.27,38.1 53.95,39.78 53.95,40.54 IC10.60
GATE  (via drill 0.3)
  Top 0.152: v60.81,67.82 60.81,69.95 64.31,73.46 v64.31,81.08 | v64.31,85.65 64.31,91.29 v67.06,94.03
  Bottom 0.152: Q2.C 70.41,104.09 69.95,104.09 67.97,102.11 67.97,94.94 R60.1 67.82,94.79 v67.06,94.03 | v60.81,67.82 56.24,63.25 56.24,54.71 55.63,54.1 55.63,52.43 IC10.24 | v64.31,85.65 v64.31,81.08
GND  (via drill 0.3)
  Top 0.152: v52.58,31.7 52.58,28.04 R26.P$3 | 40.08,43.59 37.95,43.59 36.27,41.91 R9.P$3 | 40.08,43.59 v43.13,43.59 46.48,40.23 v46.48,38.86 | R24.P$3 20.12,28.04 20.12,41.76 R8.P$3 | J16.GND 36.42,11.43 36.42,13.72 36.27,13.87 R83.P$3 36.27,14.02 37.49,15.24 37.49,20.57 36.27,21.79 36.27,27.89 R65.P$3 36.27,28.04 40.54,32.31 40.54,33.07 40.08,33.53 40.08,43.59 | 64.77,27.89 64.77,27.43 63.86,26.52 JP1.9 | 64.77,27.89 63.86,28.8 JP1.5 63.86,28.96 63.86,30.18 JP1.3 | J5.P1 78.64,30.33 70.87,30.33 68.58,28.04 R66.P$3 | 64.77,27.89 65.84,27.89 66.14,28.19 68.28,28.19 68.43,28.04 R66.P$3 | J17.GND 52.73,11.43 52.73,13.72 52.58,13.87 R84.P$3 | 78.79,11.43 78.79,6.86 J8.P1 | 78.79,11.43 78.79,16.15 J7.P1 | 78.79,11.43 68.89,11.43 J18.GND 68.73,11.43 68.73,13.72 68.58,13.87 R85.P$3 68.58,14.02 68.58,27.89 R66.P$3 | R76.P$3 4.27,83.67 4.27,73 4.42,72.85 4.42,70.1 4.27,69.95 R61.P$3 | v8.38,51.21 4.27,55.32 4.27,55.78 R3.P$3 | J15.GND 20.27,11.43 20.27,13.72 20.12,13.87 R82.P$3 | J14.GND 4.27,11.43 4.27,13.87 R81.P$3 4.27,14.02 4.27,19.51 4.42,19.66 4.42,27.74 4.27,27.89 R64.P$3 4.27,28.04 4.27,33.53 4.42,33.68 4.42,41.6 4.27,41.76 R7.P$3 | R4.P$3 20.12,55.93 20.12,69.8 R25.P$3 | 16.15,97.69 24.69,97.69 J10.GND 24.84,97.54 40.84,97.54 J11.GND | 16.15,97.69 8.99,97.69 J9.GND | 16.15,97.69 16.15,85.65 17.98,83.82 19.96,83.82 R77.P$3 | v57.45,53.49 58.37,53.49 60.2,51.66 61.72,51.66 | 61.72,51.66 70.1,51.66 72.85,48.92 72.85,47.24 72.24,46.63 LED2.K | 61.72,51.66 v61.72,51.36 | J6.P1 78.64,40.39 78.64,52.12 77.88,52.88 J1.P$3 77.88,57.3 78.03,57.45 78.03,65.53 J4.P$3 | JP3.4 86.26,99.21 86.26,96.77 JP3.3 86.11,96.77 83.67,96.77
  Top 0.152: 83.67,96.77 83.67,99.21 JP3.6 | J3.P1 78.79,87.17 81.08,87.17 J3.P2 81.23,87.17 81.23,88.7 81.38,88.85 81.38,96.32 | 82.3,107.59 83.97,107.59 U$1.K | 82.3,107.59 81.53,107.59 U$1.4 | JP3.7 81.08,96.77 81.08,99.21 JP3.8 81.08,99.36 81.38,99.67 81.38,102.41 U$1.3 81.53,102.56 82.3,103.33 82.3,107.59 | 81.38,96.32 81.08,96.62 JP3.7 | 81.38,96.32 81.69,96.62 83.52,96.62 JP3.5 83.67,96.77 | 81.38,96.32 JP3.7 | v52.58,50.6 52.58,55.78 R6.P$3 | J4.P$3 77.88,65.53 73.15,65.53 72.24,64.62 LED1.K | v59.74,99.06 58.67,99.06 57.3,97.69 J12.GND | J4.P$3 78.03,65.68 78.03,76.2 J2.P$3
  Bottom 0.152: IC10.63 52.43,40.54 52.43,39.78 52.27,39.62 50.14,39.62 C22.2 49.99,39.62 48.77,38.41 46.48,38.41 | 54.1,36.12 54.1,34.44 54.25,34.29 54.25,33.53 C18.2 54.25,33.38 v52.58,31.7 | 54.1,36.12 54.25,36.27 C17.2 54.1,36.12 | 54.1,36.12 52.58,36.12 52.12,36.58 47.7,36.58 R50.1 47.55,36.42 46.79,35.66 45.41,35.66 45.11,35.97 45.11,37.03 46.48,38.41 | v43.13,43.59 44.2,44.65 45.41,44.65 Q1.GND | R9.P$3 36.12,41.76 27.43,41.76 26.06,43.13 21.34,43.13 20.12,41.91 R8.P$3 | v46.48,38.86 46.48,38.41 | IC6.10 48.01,9.91 47.55,9.91 IC6.11 47.4,9.91 46.79,9.91 IC6.12 46.63,9.91 46.63,10.67 46.02,11.28 36.58,11.28 J16.GND 36.42,11.28 32,11.28 31.39,10.67 31.39,9.91 IC13.10 31.24,9.91 30.79,9.91 IC13.11 30.63,9.91 30.02,9.91 IC13.12 | 31.24,14.94 30.94,14.63 30.33,14.63 30.02,14.94 30.02,15.54 IC13.3 | 31.24,14.94 31.24,15.54 IC13.5 | 35.2,14.94 36.12,14.02 R83.P$3 | 35.2,14.94 34.59,15.54 | 34.59,15.54 31.55,18.59 31.55,19.36 C51.2 | 31.24,14.94 31.55,14.63 33.68,14.63 34.59,15.54 | C35.2 63.09,38.71 63.09,35.05 64.77,33.38 64.77,31.24 63.86,30.33 JP1.3 | 46.63,16.46 46.33,16.76 46.33,18.59 C29.2 | 46.63,16.46 46.63,15.7 IC6.3 46.63,15.54 46.63,14.94 46.33,14.63 44.5,14.63 42.67,16.46 36.73,16.46 35.2,14.94 | 46.63,16.46 46.94,16.76 47.7,16.76 48.01,16.46 48.01,15.7 IC6.5 48.16,15.54 48.16,14.94 49.07,14.02 52.43,14.02 R84.P$3 | IC9.5 64.62,6.25 64.62,11.43 IC9.4 | 60.2,8.23 60.2,5.33 60.66,4.88 60.66,2.9 C23.2 | 60.2,8.23 63.4,11.43 IC9.3 63.4,11.58 64.62,11.58 IC9.4 | J18.GND 68.73,11.43 64.77,11.43 IC9.4 | 60.2,8.23 57.15,11.28 52.88,11.28 J17.GND | 9.14,50.44 13.56,54.86 13.56,55.63 R59.1
  Bottom 0.152: 9.14,50.44 9.14,47.85 11.12,45.87 11.58,45.87 12.8,44.65 IC14.5 | R61.P$3 4.12,69.8 3.66,69.34 3.66,66.75 R69.1 3.66,66.6 3.66,65.38 4.72,64.31 4.72,59.74 4.27,59.28 4.27,55.93 R3.P$3 4.27,55.78 4.27,53.95 4.72,53.49 4.72,42.37 4.27,41.91 R7.P$3 4.27,41.76 5.33,40.69 7.62,40.69 7.92,41 7.92,43.13 9.3,44.5 | v8.38,51.21 9.14,50.44 | IC7.12 14.02,9.91 14.48,9.91 IC7.11 14.63,9.91 15.24,9.91 IC7.10 15.39,9.91 15.39,12.34 | C32.2 15.39,19.05 15.39,15.7 IC7.5 15.24,15.54 15.24,14.94 14.94,14.63 | 14.94,14.63 14.33,14.63 14.02,14.94 14.02,15.54 IC7.3 | 15.39,14.02 15.39,14.17 14.94,14.63 | 15.39,14.02 15.39,12.34 | 15.39,12.34 14.02,12.34 13.11,11.43 4.42,11.43 J14.GND | 15.39,14.02 19.96,14.02 R82.P$3 | C45.1 10.97,38.1 12.19,38.1 12.34,37.95 13.11,37.95 13.87,38.71 13.87,39.32 IC14.3 13.87,39.47 13.87,39.93 9.3,44.5 | 9.3,44.5 9.3,44.96 C44.2 | R77.P$3 20.12,83.67 20.12,69.95 R25.P$3 | IC5.7 12.95,99.21 12.5,99.21 IC5.8 12.34,99.21 11.89,99.67 | 11.89,99.67 11.89,105.31 13.56,106.98 14.94,106.98 C37.2 | 11.89,99.67 9.91,97.69 8.99,97.69 J9.GND 8.84,97.54 7.62,96.32 7.62,89.15 4.27,85.8 4.27,83.82 R76.P$3 | IC8.1 32.77,99.21 32.31,99.21 IC8.2 32.16,99.21 32.16,100.74 31.55,101.35 31.09,101.35 30.33,100.58 | 30.48,99.21 30.79,99.21 IC8.4 | 30.48,99.21 30.33,99.21 IC8.5 | 29.72,99.97 29.41,99.97 28.96,99.52 28.96,99.21 IC8.7 28.8,99.21 28.35,99.21 IC8.8 28.19,99.06 26.21,99.06 24.84,97.69 J10.GND | 30.48,99.21 29.72,99.97 | 29.72,99.97 30.33,100.58 | IC11.12 46.02,104.85 46.02,105.16 45.26,105.92 36.73,105.92 34.59,108.05 31.85,108.05 30.94,107.14 C13.2 30.94,106.98 30.33,106.38 28.04,106.38 27.43,105.77 27.43,103.48 30.33,100.58
  Bottom 0.152: 33.38,80.92 32.92,80.92 IC4.1 33.38,80.92 | 33.38,80.92 36.12,83.67 R78.P$3 36.27,83.67 36.58,83.67 37.64,82.6 39.78,82.6 40.08,82.91 40.08,87.94 40.23,88.09 C9.- 40.39,88.24 40.39,97.08 40.84,97.54 J11.GND 41,97.69 42.37,99.06 44.04,99.06 IC11.8 44.2,99.21 44.65,99.21 IC11.7 | 32,69.49 31.55,69.49 31.39,69.34 30.18,69.34 29.87,69.65 C7.2 | 32,69.49 32.16,69.49 C5.2 | 32,69.49 32,68.28 32.46,67.82 34.14,67.82 36.12,69.8 R62.P$3 36.27,69.8 36.58,69.8 37.8,68.58 46.18,68.58 48.46,70.87 C4.2 48.62,70.87 49.38,70.87 | 32,69.49 C5.2 | 49.38,70.87 51.51,70.87 52.43,69.95 R23.P$3 52.58,69.95 52.88,69.95 54.25,71.32 58.98,71.32 60.66,69.65 60.66,68.43 | 47.55,75.13 46.79,75.13 C8.2 | 47.55,75.13 49.38,73.3 49.38,70.87 | 47.55,75.13 48.77,76.35 48.77,80.77 IC2.1 | 33.38,80.92 33.38,80.16 36.42,77.11 36.42,73.3 32.77,69.65 32.31,69.65 C5.2 | IC12.22 70.26,59.59 69.65,59.59 IC12.21 69.49,59.59 69.49,60.5 69.19,60.81 66.14,60.81 65.84,60.5 65.84,59.59 IC12.15 65.68,59.44 65.68,58.98 63.25,56.54 62.79,56.54 | 62.79,56.54 62.79,54.41 61.87,53.49 61.87,52.43 C48.2 61.72,52.27 v61.72,51.36 | 62.79,56.54 61.87,57.45 C31.2 61.87,57.61 62.18,57.91 62.18,60.05 C46.2 | v57.45,53.49 57.45,52.43 IC10.28 | 71.02,47.7 72.08,46.63 LED2.K | 71.02,47.7 67.67,51.05 67.67,51.97 IC12.11 | C57.2 85.5,50.9 83.21,50.9 R87.1 83.06,51.05 83.06,57.3 81.23,59.13 C52.- 81.08,59.13 78.18,59.13 76.96,57.91 76.35,57.91 C47.2 76.2,57.76 76.2,57.45 75.44,56.69 75.44,55.32 77.72,53.03 J1.P$3 77.72,52.88 77.72,50.75 | 77.72,50.75 76.05,50.75 C38.2 75.89,50.6 73.91,50.6 71.02,47.7
  Bottom 0.152: 77.72,50.75 78.49,50.75 C36.2 | Q2.E 69.65,102.11 69.95,102.11 70.87,103.02 71.93,103.02 72.69,102.26 72.69,97.69 J13.GND | C3.- 69.34,87.78 69.34,92.66 71.02,94.34 72.24,94.34 72.69,94.79 72.69,97.54 J13.GND | J13.GND 72.85,97.69 77.72,97.69 78.03,97.99 79.7,97.99 80.92,96.77 JP3.7 | 52.73,50.75 52.58,50.9 52.58,52.27 IC10.18 | 52.73,50.75 54.1,49.38 54.1,47.24 53.03,46.18 52.73,46.18 50.75,48.16 49.84,48.16 IC10.12 | 47.09,54.86 47.09,53.8 47.24,53.65 47.24,52.73 C21.2 | 47.09,54.86 48.01,55.78 C33.2 48.16,55.78 48.92,55.02 51.66,55.02 52.43,55.78 R6.P$3 52.58,55.93 52.58,58.67 55.93,62.03 55.93,63.4 60.2,67.67 60.2,67.97 60.66,68.43 | 47.09,54.86 45.41,54.86 44.5,55.78 44.2,55.78 C34.2 44.04,55.78 42.82,54.56 37.8,54.56 36.58,55.78 36.27,55.78 R5.P$3 | v52.58,50.6 52.73,50.75 | IC12.28 74.22,59.59 74.22,61.72 74.98,62.48 74.98,63.7 76.81,65.53 77.88,65.53 J4.P$3 | 65.53,66.14 65.53,65.68 C39.2 | 65.53,66.14 67.97,68.58 67.97,68.73 | 67.97,68.73 67.97,69.8 R63.P$3 | 67.97,68.73 72.08,64.62 LED1.K | IC3.8 60.66,99.21 61.11,99.21 IC3.7 | 59.89,106.07 60.05,106.07 60.96,106.98 63.09,106.98 C16.2 | 59.89,106.07 47.55,106.07 46.63,106.98 C6.2 | 59.89,106.07 59.89,104.39 60.5,103.78 60.5,99.21 IC3.8 | 83.67,75.13 83.67,73.15 84.43,72.39 C54.2 | 83.67,75.13 83.67,75.89 84.43,76.66 R74.1 | 83.67,75.13 79.1,75.13 78.03,76.2 J2.P$3 77.88,76.35 74.83,79.4 | IC1.1 63.55,86.41 63.55,84.43 C2.2 | IC1.1 63.7,86.41 65.53,86.41 67.97,83.97 R80.P$3 67.97,83.82 72.24,79.55 C1.+ 72.39,79.4 74.83,79.4 | 57.3,88.09 62.03,88.09 63.55,86.56 IC1.1 | 57.3,88.09 56.54,88.09 C10.-
  Bottom 0.152: 57.3,88.09 57.3,97.54 J12.GND | 57.3,88.09 C10.- | R79.P$3 52.58,83.67 52.88,83.67 53.95,82.6 56.08,82.6 56.24,82.75 56.24,87.94 56.39,88.09 C10.- | v59.74,99.06 60.5,99.06 IC3.8 | 60.66,68.43 63.25,68.43 65.53,66.14 | 74.83,79.4 78.64,83.21 78.64,87.02 J3.P1 | R66.P$3 68.58,28.04 68.58,30.63 78.18,40.23 78.64,40.23 J6.P1
  pour Top (isolate 0.012): 91,0 0,0 0,109 91,109
  pour Bottom (isolate 0.012): 91,0 0,0 0,109 91,109
I2C_SCL
  Bottom 0.152: 71.63,60.5 74.07,62.94 R52.1 | 71.63,60.5 71.63,59.59 IC12.24 | 71.63,60.5 70.26,61.87 62.48,61.87 60.35,59.74 60.35,56.39 58.06,54.1 58.06,52.43 IC10.29
I2C_SDA  (via drill 0.3)
  Top 0.152: v70.41,60.96 68.89,62.48 v66.29,62.48 66.29,66.9 65.68,67.51 65.38,67.51 64.92,67.06 64.92,62.64 61.72,59.44 v61.27,59.44
  Bottom 0.152: v66.29,62.48 65.53,63.25 R53.1 | v70.41,60.96 70.87,60.5 70.87,59.59 IC12.23 | v61.27,59.44 60.66,58.83 60.66,56.24 58.52,54.1 58.52,52.43 IC10.30
I2S_LRCK  (via drill 0.3)
  Top 0.152: v62.48,51.05 69.34,51.05 v69.8,50.6
  Bottom 0.152: v62.48,51.05 61.72,50.29 IC10.33 | 70.26,51.05 v69.8,50.6 | 70.26,51.05 70.26,51.97 IC12.7 | 70.26,51.05 70.56,50.75 71.17,50.75 71.48,51.05 71.48,51.97 IC12.5
I2S_MCK  (via drill 0.3)
  Top 0.152: v60.5,48.31 60.81,48.31 v62.79,50.29
  Bottom 0.152: v60.5,48.31 61.57,48.31 IC10.37 | v62.79,50.29 64.47,51.97 64.47,53.8 67.21,56.54 70.1,56.54 72.08,58.52 72.08,59.44 IC12.25
I2S_SCK
  Bottom 0.152: IC10.34 61.72,49.68 62.94,49.68 64.77,51.51 64.77,53.65 65.23,54.1 71.63,54.1 72.85,52.88 72.85,52.12 IC12.3
I2S_SIN  (via drill 0.3)
  Top 0.152: v62.18,54.56 62.18,57 63.7,58.52 65.23,58.52 v70.26,53.49
  Bottom 0.152: v62.18,54.56 60.81,53.19 60.81,49.38 60.96,49.23 61.57,49.23 IC10.35 | v70.26,53.49 70.87,52.88 70.87,52.12 IC12.6
I2S_SOUT  (via drill 0.3)
  Top 0.152: v67.97,48.77 69.8,48.77 v71.02,49.99
  Bottom 0.152: v67.97,48.77 61.72,48.77 IC10.36 | v71.02,49.99 72.08,51.05 72.08,51.97 IC12.4
JTCK
  Bottom 0.152: IC10.49 59.59,40.54 59.59,37.19 61.72,35.05 61.72,31.09 62.48,30.33 JP1.4
JTDI  (via drill 0.3)
  Top 0.152: v58.98,38.56 58.98,38.25 61.72,35.51 61.72,28.5 62.48,27.74 JP1.8
  Bottom 0.152: v58.98,38.56 58.98,40.54 IC10.50
JTDO
  Bottom 0.152: IC10.55 56.54,40.54 56.54,37.34 57.45,36.42 57.45,33.98 62.48,28.96 JP1.6
JTMS
  Bottom 0.152: IC10.46 61.57,43.74 60.96,43.74 60.81,43.59 60.81,36.42 62.48,34.75 62.48,31.55 JP1.2
LED_GATE  (via drill 0.3)
  Top 0.152: v63.09,47.7 66.14,47.7 78.03,35.81 v79.86,35.81
  Bottom 0.152: R90.1 76.05,107.44 74.68,106.07 74.68,104.09 75.44,103.33 75.44,103.02 R10.1 75.59,102.87 76.66,102.87 79.7,99.82 79.7,98.91 80.62,97.99 81.53,97.99 82.3,97.23 82.3,96.32 90.37,88.24 90.37,86.56 88.24,84.43 88.24,50.44 85.65,47.85 85.65,46.18 82.91,43.43 82.91,39.17 79.86,36.12 v79.86,35.81 | v63.09,47.7 61.72,47.7 IC10.38
LIN  (via drill 0.3)
  Top 0.152: v70.1,57.45 73.3,57.45 v73.61,57.15
  Bottom 0.152: v70.1,57.45 69.04,58.52 69.04,59.44 IC12.20 | v73.61,57.15 74.22,57.15 77.72,60.66 85.04,60.66 86.41,59.28 C56.+
LOUT
  Bottom 0.152: IC12.12 67.06,51.97 67.06,50.9 71.17,46.79 71.17,46.18 74.37,42.98 C40.+
LOUT_JACK  (via drill 0.3)
  Top 0.152: v52.58,64.16 55.17,64.16 60.5,58.83 65.38,58.83 70.1,54.1 70.41,54.1 74.52,49.99 74.52,41.91 82.91,33.53 82.91,12.8 88.85,6.86 J8.P3
  Bottom 0.152: v52.58,64.16 52.58,64.31 49.84,67.06 43.74,67.06 41.15,64.47 21.49,64.47 19.36,66.6 15.09,66.6 R89.1
N$1
  Bottom 0.152: R43.1 13.87,29.72 15.09,29.72 16,28.8 17.22,28.8 18.75,27.28 18.75,24.38 21.18,21.95 21.18,12.04 21.34,11.89 21.34,2.59 22.4,1.52 J15.TIP
N$2
  Bottom 0.152: C28.1 13.72,26.21 13.72,28.04 R43.2 13.87,28.04 16.46,28.04 | 16.46,28.04 16.46,26.21 R29.1 16.61,26.06 19.05,23.62 19.05,23.16 18.59,22.71 17.53,22.71 16.15,21.34 16.15,18.44 16,18.29 16,15.7 IC7.6 | 16.46,28.04 R42.2
N$3
  Bottom 0.152: R18.2 17.07,2.59 14.94,2.59 R22.1 14.78,2.74 14.78,5.64 R21.1 14.94,5.64 16,5.64 | 16,5.64 17.07,5.64 C20.2 | 16,5.64 16,9.75 IC7.9
N$4  (via drill 0.3)
  Top 0.152: v31.24,26.98 31.24,13.87 36.27,8.84 44.2,8.84 v46.79,11.43
  Bottom 0.152: v31.24,26.98 31.24,28.65 32.16,29.57 R71.1 | v46.79,11.43 49.84,11.43 58.06,3.2 58.06,2.13 59.28,0.91 70.41,0.91 70.87,1.37 J18.TIP
N$5
  Bottom 0.152: 24.84,5.03 24.99,5.03 26.36,3.66 C41.2 | 24.84,5.03 24.08,5.03 R54.1 | 24.84,8.69 26.21,8.69 R48.2 26.36,8.69 28.96,8.69 29.26,8.99 29.26,9.75 IC13.13 | 24.84,8.69 24.08,8.69 R55.1 | 24.84,8.69 24.84,5.03
N$6  (via drill 0.3)
  Top 0.152: v43.89,26.06 43.89,27.28 49.38,32.77 51.36,32.77 53.19,34.59 53.19,39.78 47.55,45.41 42.98,45.41 v42.37,46.02 | v31.7,57.45 31.7,66.29 v30.79,67.21 | v28.5,75.13 28.5,75.44 28.8,75.74 28.8,78.94 26.82,80.92 v26.82,83.82 | v26.06,98.15 26.06,98.6 v24.69,99.97 | v28.04,107.29 33.38,107.29 34.14,106.53 37.8,106.53 38.71,107.44 J11.TIP
  Bottom 0.152: v43.89,26.06 45.41,24.54 R33.1 | v42.37,46.02 42.37,46.63 34.44,54.56 34.44,55.93 32.61,57.76 32,57.76 v31.7,57.45 | v30.79,67.21 27.58,70.41 27.58,74.22 v28.5,75.13 | v26.82,83.82 26.82,87.94 24.99,89.76 24.99,96.32 26.06,97.38 v26.06,98.15 | v24.69,99.97 24.69,101.04 26.82,103.17 26.82,106.07 v28.04,107.29
N$7
  Bottom 0.152: IC10.5 49.68,44.81 47.24,44.81 46.02,43.59 45.57,43.59 Q1.X2
N$8
  Bottom 0.152: IC10.6 49.68,45.26 46.18,45.26 45.57,45.87 Q1.X1
N$9
  Bottom 0.152: IC13.1 28.8,15.7 29.26,15.7 IC13.2
N$10  (via drill 0.3)
  Top 0.152: v41.3,23.77 44.5,23.77 44.81,24.08 v56.08,24.08 | v63.7,24.69 63.7,20.42 67.21,16.92 67.21,11.28 70.56,7.92 75.89,7.92 78.64,5.18 89,5.18 90.53,6.71 90.53,64.47 89.46,65.53 J4.P$1
  Bottom 0.152: v41.3,23.77 39.93,25.15 R30.1 | v56.08,24.08 57.45,24.08 58.06,24.69 v63.7,24.69
N$11
  Bottom 0.152: R22.2 13.11,2.59 7.77,2.59 6.71,1.52 J14.TIP
N$12
  Bottom 0.152: R70.2 28.8,27.89 28.8,26.21 C50.1 28.8,26.06 29.11,26.06 30.63,24.54 | R71.2 32.16,27.89 32.16,26.21 R73.1 32.16,26.06 30.63,24.54 | 30.63,24.54 30.63,18.9 31.85,17.68 31.85,15.7 IC13.6
N$13
  Bottom 0.152: IC10.47 61.72,43.13 62.48,43.13 64.92,40.69 64.92,38.86 C35.1
N$15
  Bottom 0.152: R30.2 39.78,23.47 37.49,23.47 C26.1 37.49,23.32 37.49,19.51 R34.1 37.64,19.36 39.32,17.68 39.93,17.68 R31.2 40.08,17.53 44.96,17.53 46.02,16.46 46.02,15.7 IC6.2
N$17  (via drill 0.3)
  Top 0.152: v75.13,49.84 v67.82,57.15
  Bottom 0.152: 79.4,56.08 81.08,56.08 C52.+ | 79.4,56.08 76.35,56.08 C47.1 | v67.82,57.15 66.45,58.52 66.45,59.44 IC12.16 | v75.13,49.84 79.25,49.84 79.4,49.99 79.4,56.08
N$18
  Bottom 0.152: 84.73,48.31 84.73,46.79 R86.1 | 84.73,48.31 85.5,49.07 C57.1 85.65,49.07 86.72,50.14 86.72,51.66 86.56,51.82 86.56,55.93 C56.- | 84.73,48.31 83.82,49.23 83.21,49.23 R87.2
N$19
  Bottom 0.152: IC10.31 58.98,52.43 58.98,53.65 60.96,55.63 61.72,55.63 C31.1
N$20  (via drill 0.3)
  Top 0.152: v85.8,71.32 87.94,69.19 87.94,41 87.63,40.69 87.63,31.7 88.85,30.48 J5.P3
  Bottom 0.152: v85.8,71.32 85.34,71.78 85.34,73 84.58,73.76 84.58,75.13 R75.2
N$21
  Bottom 0.152: R86.2 86.56,46.63 86.56,42.52 88.7,40.39 J6.P3
N$22
  Bottom 0.152: R74.2 86.11,78.33 86.11,75.29 R75.1 86.26,75.13 86.26,72.39 C54.1 86.26,72.24 86.41,72.08 86.41,67.67 C55.-
N$23  (via drill 0.3)
  Top 0.152: v15.39,54.56 15.39,48.01 17.98,45.41 17.98,37.19 16,35.2 16,22.1 11.73,17.83 11.73,10.97 14.78,7.92 25.45,7.92 v27.89,10.36 | v58.22,24.08 v46.79,12.65
  Bottom 0.152: R58.2 15.39,57.76 15.39,55.78 R59.2 15.39,55.63 v15.39,54.56 | v27.89,10.36 30.18,12.65 v46.79,12.65 | v58.22,24.08 63.86,24.08 67.21,27.43 67.21,30.48 74.37,37.64 74.37,39.62 C40.-
N$24  (via drill 0.3)
  Top 0.152: v13.72,7.01 13.72,6.71 16.61,3.81 34.14,3.81 34.29,3.66 54.86,3.66 55.47,4.27 63.4,4.27 v68.43,9.3 | v71.63,12.5 74.22,12.5 77.42,15.7 77.42,21.34 v82.3,26.21 | v88.7,38.56 90.07,39.93 90.07,50.75 88.24,52.58 88.24,86.11 87.63,86.72 v87.63,95.71
  Bottom 0.152: v13.72,7.01 12.95,7.01 10.36,4.42 6.4,4.42 5.64,3.66 4.57,3.66 R19.2 | v71.63,12.5 v68.43,9.3 | v82.3,26.21 85.95,29.87 85.95,35.81 v88.7,38.56 | v87.63,95.71 87.63,96.01 87.33,96.32 87.33,100.28 85.04,102.56 85.04,102.72 81.23,106.53 80.31,106.53 78.49,108.36 71.48,108.36 70.71,107.59 J13.TIP
N$25
  Bottom 0.152: R58.1 13.72,57.76 14.33,57.15 14.33,55.02 13.72,54.41 13.72,53.49 C43.1 13.56,53.34 13.56,52.73 12.8,51.97 12.8,49.99 13.56,49.23 R51.2 13.72,49.07 13.72,44.81 13.87,44.65 IC14.6
N$27
  Bottom 0.152: R54.2 24.08,3.35 24.69,3.35 26.67,1.37 38.71,1.37 J16.TIP
N$28
  Bottom 0.152: C43.2 15.24,53.34 15.24,51.51 R88.2 15.39,51.36 15.39,49.23 R51.1 15.39,49.07 15.39,44.65 IC14.7
N$31  (via drill 0.3)
  Top 0.152: v5.18,65.08 5.18,61.72 2.59,59.13 2.59,53.95 7.92,48.62 7.92,12.04 16.46,3.5 33.98,3.5 34.44,3.05 60.66,3.05 v61.87,1.83 | v63.4,10.21 63.4,14.17 65.84,16.61 65.84,17.83 63.09,20.57 63.09,24.84 63.7,25.45 64.16,25.45 v66.29,27.58
  Bottom 0.152: R68.2 6.71,66.75 5.33,66.75 R69.2 5.18,66.6 v5.18,65.08 | v61.87,1.83 61.87,4.88 61.42,5.33 61.42,8.23 v63.4,10.21 | v66.29,27.58 66.29,30.02 69.04,32.77 69.04,39.62 C53.-
N$32
  Bottom 0.152: 9.14,66.75 10.06,66.75 R72.2 | 9.14,66.75 8.53,66.75 R68.1 | C49.1 18.75,38.25 17.68,38.25 17.07,37.64 16,37.64 15.39,38.25 15.39,39.32 IC14.2 15.24,39.47 15.24,39.93 14.48,40.69 13.87,40.69 10.06,44.5 10.06,45.72 7.77,48.01 7.77,51.36 10.67,54.25 10.67,59.74 9.14,61.27 9.14,66.75
N$33
  Bottom 0.152: R72.1 11.89,66.75 13.26,66.75 R89.2 13.41,66.6 13.41,63.25 15.09,61.57 15.09,59.89 17.53,57.45 17.53,50.75 16.15,49.38 16.15,46.02 15.85,45.72 15.85,43.28 15.54,42.98 15.54,41.3 16.46,40.39 16.46,39.47 IC14.1 16.61,39.47 19.66,39.47 20.42,38.71 20.42,38.41 C49.2
N$35
  Bottom 0.152: R57.2 28.96,5.79 28.96,5.18 29.87,4.27 29.87,1.98 30.18,1.68 37.34,1.68 38.25,2.59 43.89,2.59 44.96,1.52 55.02,1.52 J17.TIP
N$37